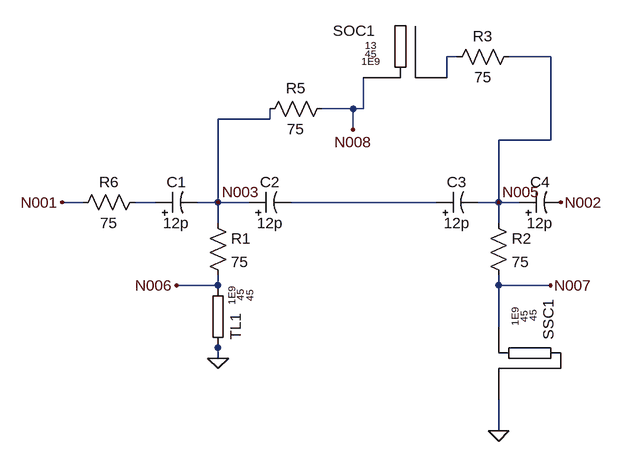
[diagram p0: schematic 1_Circuito_Extra_ABCD.asc]
1_Circuito_Extra_ABCD.asc, the LTspice schematic file:
Version 4
SHEET 1 880 680
WIRE 432 -144 416 -144
WIRE 576 -144 512 -144
WIRE 416 -112 416 -144
WIRE 272 -64 224 -64
WIRE 288 -64 288 -112
WIRE 288 -64 272 -64
WIRE 144 -48 144 -64
WIRE 144 -48 64 -48
WIRE 272 -32 272 -64
WIRE 576 -16 576 -144
WIRE 576 -16 496 -16
WIRE -144 80 -176 80
WIRE -32 80 -64 80
WIRE 64 80 64 -48
WIRE 64 80 32 80
WIRE 112 80 64 80
WIRE 400 80 176 80
WIRE 496 80 496 -16
WIRE 496 80 464 80
WIRE 528 80 496 80
WIRE 64 112 64 80
WIRE 496 112 496 80
WIRE 64 208 64 192
WIRE 64 208 0 208
WIRE 496 208 496 192
WIRE 576 208 496 208
WIRE 496 272 496 208
WIRE 64 304 64 288
WIRE 64 320 64 304
WIRE 496 432 496 384
FLAG 496 432 0
FLAG 592 80 N002
FLAG 64 80 N003
FLAG 496 80 N005
FLAG 64 320 0
FLAG 576 208 N007
FLAG 272 -32 N008
FLAG 0 208 N006
FLAG -176 80 N001
SYMBOL res 48 96 R0
SYMATTR InstName R1
SYMATTR Value 75
SYMBOL res 480 96 R0
SYMATTR InstName R2
SYMATTR Value 75
SYMBOL polcap 112 96 R270
WINDOW 0 32 32 VTop 2
WINDOW 3 0 32 VBottom 2
SYMATTR InstName C2
SYMATTR Value 12p
SYMBOL polcap -32 96 R270
WINDOW 0 32 32 VTop 2
WINDOW 3 0 32 VBottom 2
SYMATTR InstName C1
SYMATTR Value 12p
SYMBOL polcap 400 96 R270
WINDOW 0 32 32 VTop 2
WINDOW 3 0 32 VBottom 2
SYMATTR InstName C3
SYMATTR Value 12p
SYMBOL polcap 528 96 R270
WINDOW 0 32 32 VTop 2
WINDOW 3 0 32 VBottom 2
SYMATTR InstName C4
SYMATTR Value 12p
SYMBOL res 128 -48 R270
WINDOW 0 32 56 VTop 2
WINDOW 3 0 56 VBottom 2
SYMATTR InstName R5
SYMATTR Value 75
SYMBOL TL 64 256 R90
SYMATTR InstName TL1
SYMATTR SpiceModel 45
SYMATTR Value 45
SYMATTR Value2 1E9
SYMBOL res 416 -128 R270
WINDOW 0 32 56 VTop 2
WINDOW 3 0 56 VBottom 2
SYMATTR InstName R3
SYMATTR Value 75
SYMBOL res -48 64 R90
WINDOW 0 0 56 VBottom 2
WINDOW 3 32 56 VTop 2
SYMATTR InstName R6
SYMATTR Value 75
SYMBOL SOC 384 -144 R0
SYMATTR SpiceModel 13
SYMATTR Value 45
SYMATTR Value2 1E9
SYMATTR InstName SOC1
SYMBOL SSC 544 336 R90
SYMATTR SpiceModel 45
SYMATTR Value 45
SYMATTR Value2 1E9
SYMATTR InstName SSC1

The netlist it stands for:
* 1_Circuito_Extra_ABCD.asc
R1 N003 N006 75
R2 N005 N007 75
C2 N003 N010 12p
C1 N009 N003 12p
C3 N010 N005 12p
C4 N005 N002 12p
R5 N003 N008 75
TL1 N006 0 45 45 1E9
R3 N004 N005 75
R6 N009 N001 75
SOC1 N008 N004 13 45 1E9
SSC1 N007 0 45 45 1E9
.backanno
.end